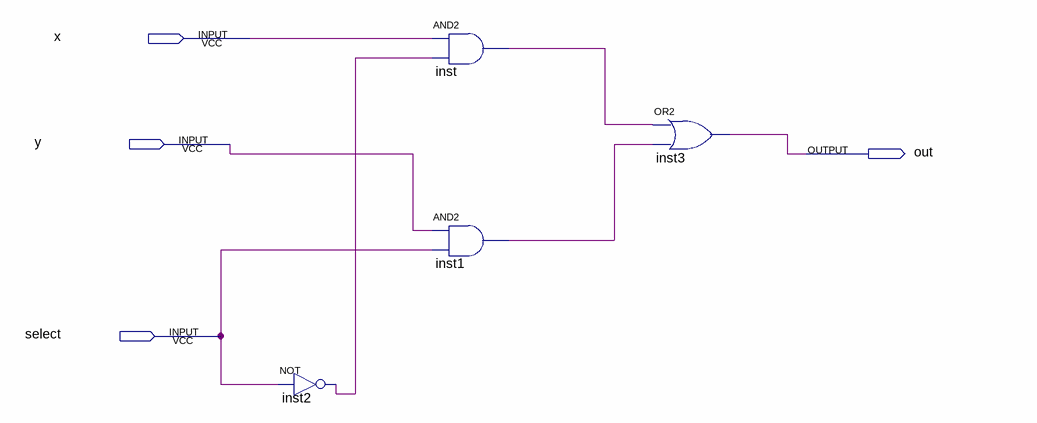
[diagram p0: schematic sheet]
// Quartus schematic 2-1MUX.bdf as structural Verilog: 4 symbols, 4 pins
module \2-1MUX  (
  input  x,
  input  y,
  input  select,
  output out
);

  wire inst1_out, inst2_out, inst_out;

  not inst2 (inst2_out, select);
  and inst (inst_out, x, inst2_out);
  and inst1 (inst1_out, y, select);
  or inst3 (out, inst_out, inst1_out);
endmodule
